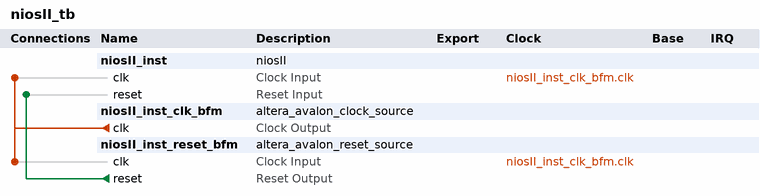
[diagram p0: system contents]
# Platform Designer (Qsys) system niosII_tb, Cyclone IV E EP4CE115F29C7
# Parameters at their usual value, and those the tool derives, are not listed.
package require -exact qsys 18.1
create_system niosII_tb
set_project_property DEVICE_FAMILY {Cyclone IV E}
set_project_property DEVICE EP4CE115F29C7

add_instance niosII_inst niosII 1.0

add_instance niosII_inst_clk_bfm altera_avalon_clock_source 18.1

add_instance niosII_inst_reset_bfm altera_avalon_reset_source 18.1
set_instance_parameter_value niosII_inst_reset_bfm ASSERT_HIGH_RESET 0
set_instance_parameter_value niosII_inst_reset_bfm INITIAL_RESET_CYCLES 50

# connections
add_connection niosII_inst_clk_bfm.clk niosII_inst.clk clock
add_connection niosII_inst_clk_bfm.clk niosII_inst_reset_bfm.clk clock
add_connection niosII_inst_reset_bfm.reset niosII_inst.reset reset

set_interconnect_requirement {$system} qsys_mm.clockCrossingAdapter HANDSHAKE
set_interconnect_requirement {$system} qsys_mm.enableEccProtection FALSE
set_interconnect_requirement {$system} qsys_mm.insertDefaultSlave FALSE
set_interconnect_requirement {$system} qsys_mm.maxAdditionalLatency 1

save_system niosII_tb.qsys
